# Altium schematic sheet catt.SchDoc
size A4
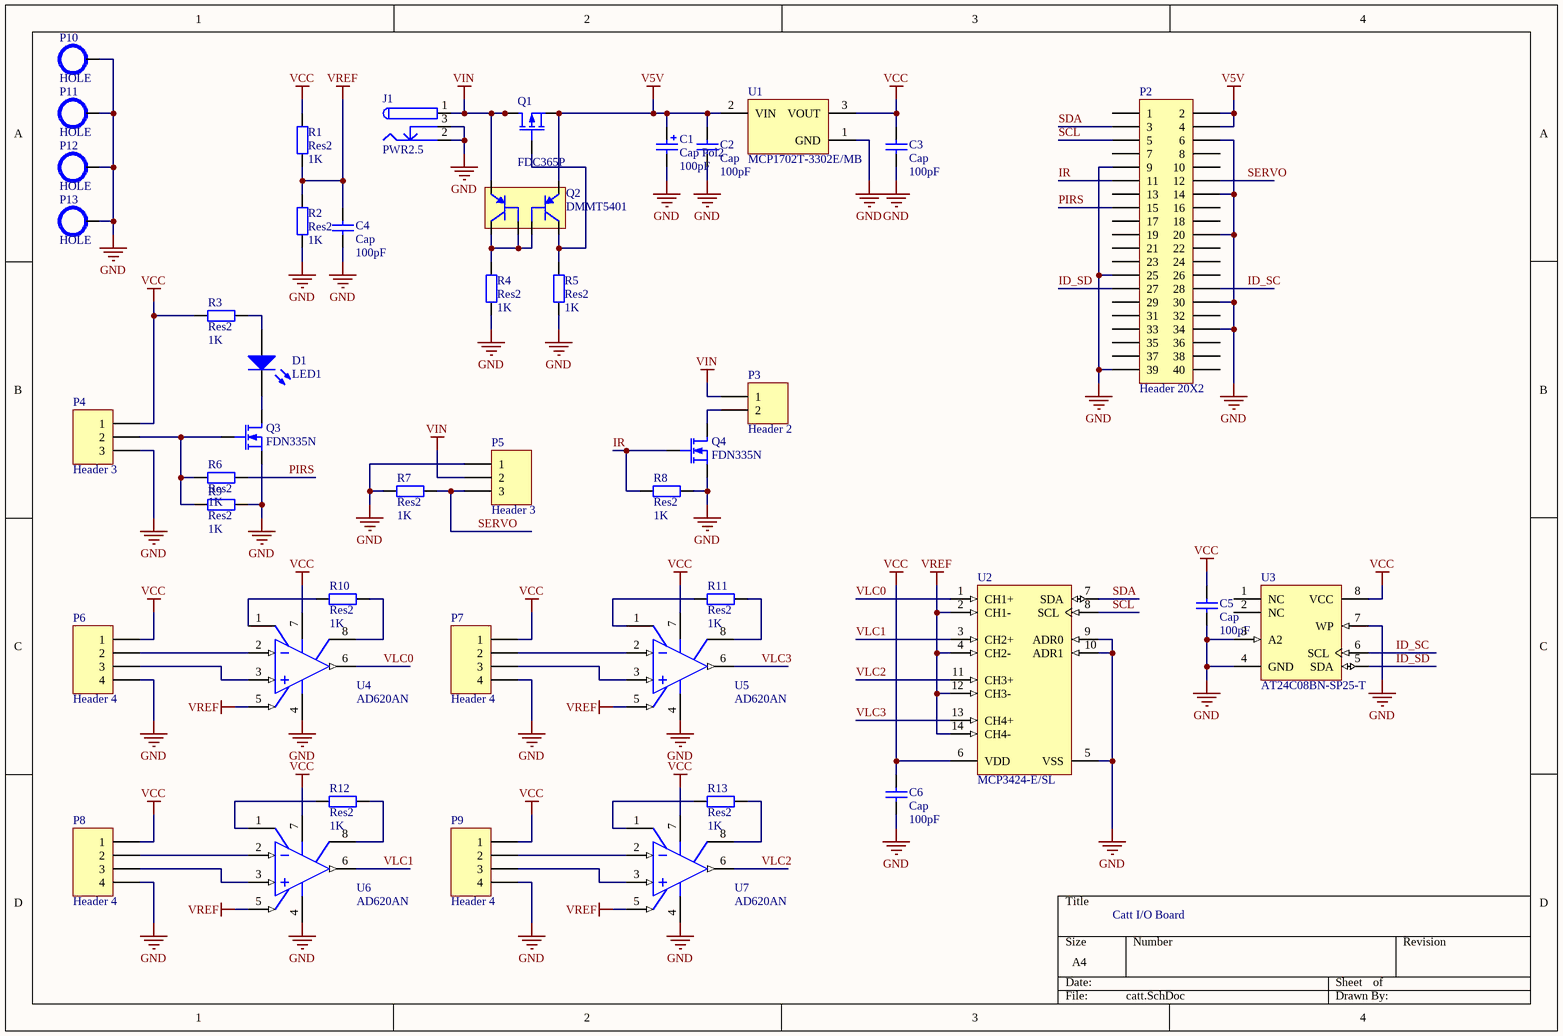
[diagram p0: catt.SchDoc]

## Parts
C1  Cap Pol2  value 100pF  [6-0805_N]
C2  Cap  value 100pF  [1608[0603]]
C3  Cap  value 100pF  [1608[0603]]
C4  Cap  value 100pF  [1608[0603]]
C5  Cap  value 100pF  [1608[0603]]
C6  Cap  value 100pF  [1608[0603]]
D1  LED1  [1608[0603]]
J1  PWR2.5  [MJ-180PH]
P2  Header 20X2  [HDR2X20]
P3  Header 2  [HDR1X2]
P4  Header 3  [HDR1X3]
P5  Header 3  [HDR1X3]
P6  Header 4  [HDR1X4]
P7  Header 4  [HDR1X4]
P8  Header 4  [HDR1X4]
P9  Header 4  [HDR1X4]
P10  HOLE  [HOLE]
P11  HOLE  [HOLE]
P12  HOLE  [HOLE]
P13  HOLE  [HOLE]
Q1  FDC365P  [SOT23-6]
Q2  DMMT5401  [SOT23-6]
Q3  FDN335N  [SOT-23]
Q4  FDN335N  [SOT-23]
R1  Res2  value 1K  [J1-0603]
R2  Res2  value 1K  [J1-0603]
R3  Res2  value 1K  [J1-0603]
R4  Res2  value 1K  [J1-0603]
R5  Res2  value 1K  [J1-0603]
R6  Res2  value 1K  [J1-0603]
R7  Res2  value 1K  [J1-0603]
R8  Res2  value 1K  [J1-0603]
R9  Res2  value 1K  [J1-0603]
R10  Res2  value 1K  [J1-0603]
R11  Res2  value 1K  [J1-0603]
R12  Res2  value 1K  [J1-0603]
R13  Res2  value 1K  [J1-0603]
U1  MCP1702T-3302E/MB  [SOT-89-MB3_N]
U2  MCP3424-E/SL  [SOIC-SL14_N]
U3  AT24C08BN-SP25-T  [8S1_N]
U4  AD620AN  [SO-8_L]
U5  AD620AN  [SO-8_L]
U6  AD620AN  [SO-8_L]
U7  AD620AN  [SO-8_L]

## Nets
GND: C1.2 C2.1 C3.1 C4.1 C5.1 C6.1 J1.2 J1.3 P2.6 P2.9 P2.14 P2.20 P2.25 P2.30 P2.34 P2.39 P4.3 P5.1 P6.4 P7.4 P8.4 P9.4 P10.0 P11.0 P12.0 P13.0 Q3.2(S) Q4.2(S) R2.1 R4.1 R5.1 R7.2 R8.2 R9.2 U1.1(GND) U2.5(VSS) U2.9(ADR0) U2.10(ADR1) U3.3(A2) U3.4(GND) U3.7(WP) U4.4(V-) U5.4(V-) U6.4(V-) U7.4(V-)
V5V: C1.1 C2.2 P2.2 P2.4 Q1.4(S) Q2.5(E2) U1.2(VIN)
VCC: C3.2 C5.2 C6.2 P4.1 P6.1 P7.1 P8.1 P9.1 R1.2 R3.2 U1.3(VOUT) U2.6(VDD) U3.8(VCC) U4.7(V+) U5.7(V+) U6.7(V+) U7.7(V+)
VIN: J1.1 P3.1 P5.2 Q1.1(D) Q1.2(D) Q1.5(D) Q1.6(D) Q2.6(E1)
VREF: C4.2 R1.1 R2.2 U2.2(CH1-) U2.4(CH2-) U2.12(CH3-) U2.14(CH4-) U4.5(REF) U5.5(REF) U6.5(REF) U7.5(REF)
ID_SC: P2.28 U3.6(SCL)
ID_SD: P2.27 U3.5(SDA)
IR: P2.11 Q4.1(G) R8.1
PIRS: P2.15 R6.2
SCL: P2.5 U2.8(SCL)
SDA: P2.3 U2.7(SDA)
SERVO: P2.12 P5.3 R7.1
VLC0: U2.1(CH1+) U4.6(OUT)
VLC1: U2.3(CH2+) U6.6(OUT)
VLC2: U2.11(CH3+) U7.6(OUT)
VLC3: U2.13(CH4+) U5.6(OUT)
NetD1_1: D1.1(A) R3.1
NetD1_2: D1.2(K) Q3.3(D)
NetP3_2: P3.2 Q4.3(D)
NetP4_2: P4.2 Q3.1(G) R6.1 R9.1
NetP6_2: P6.2 U4.2(-IN)
NetP6_3: P6.3 U4.3(+IN)
NetP7_2: P7.2 U5.2(-IN)
NetP7_3: P7.3 U5.3(+IN)
NetP8_2: P8.2 U6.2(-IN)
NetP8_3: P8.3 U6.3(+IN)
NetP9_2: P9.2 U7.2(-IN)
NetP9_3: P9.3 U7.3(+IN)
NetQ1_3: Q1.3(G) Q2.4(C2) R5.2
NetQ2_1: Q2.1(C1) Q2.2(B1) Q2.3(B2) R4.2
NetR10_1: R10.1 U4.8(RG)
NetR10_2: R10.2 U4.1(RG)
NetR11_1: R11.1 U5.8(RG)
NetR11_2: R11.2 U5.1(RG)
NetR12_1: R12.1 U6.8(RG)
NetR12_2: R12.2 U6.1(RG)
NetR13_1: R13.1 U7.8(RG)
NetR13_2: R13.2 U7.1(RG)

Not connected (* = marked no-connect by the designer): P2 1 7 8 10 13 16 17 18 19 21 22 23 24 26 29 31 32 33 35 36 37 38 40; U3 1(NC) 2(NC)

## Notes on the sheet
- Catt I/O Board

## Library data of the parts
C1 = Cap Pol2: Polarized Capacitor (Axial); Published: 8-Jun-2000; LatestRevisionDate: 17-Jul-2002; LatestRevisionNote: Re-released for DXP Platform.; PackageReference: POLAR0.8; Publisher: Altium Limited; PackageDescription: Polarized Capacitor; 2 Leads
C2-C6 = Cap: Capacitor; Published: 8-Jun-2000; LatestRevisionDate: 17-Jul-2002; LatestRevisionNote: Re-released for DXP Platform.; PackageReference: RAD-0.3; Publisher: Altium Limited; PackageDescription: Radial Cap, Thru-Hole; 2 Leads; 0.3 in Pin Spacing
D1 = LED1: Typical RED GaAs LED; Published: 8-Jun-2000; LatestRevisionDate: 08-Jul-2005; LatestRevisionNote: Mech Layer 1 removed.; PackageReference: LED-1; Publisher: Altium Limited; PackageDescription: LED; 2 Leads
J1 = PWR2.5: Low Voltage Power Supply Connector; Published: 17-Dec-2003; DatasheetDocument: 09-May-2002; Publisher: Altium Limited; ComponentLink1Description: Manufacturer Link; ComponentLink1URL: http://domino.kycon.com/internet/Products.html; Farnell: 1737251
P2 = Header 20X2: Header, 20-Pin, Dual row; LatestRevisionDate: 17-Jul-2002; LatestRevisionNote: Re-released for DXP Platform.; Publisher: Altium Limited; Farnell: 2356148
P3 = Header 2: Header, 2-Pin; LatestRevisionDate: 17-Jul-2002; LatestRevisionNote: Re-released for DXP Platform.; Publisher: Altium Limited
P4 P5 = Header 3: Header, 3-Pin; LatestRevisionDate: 17-Jul-2002; LatestRevisionNote: Re-released for DXP Platform.; Publisher: Altium Limited
P6-P9 = Header 4: Header, 4-Pin; LatestRevisionDate: 17-Jul-2002; LatestRevisionNote: Re-released for DXP Platform.; Publisher: Altium Limited
P10-P13 = HOLE: Mountiong Hole
Q1 = FDC365P: P-Channel PowerTrench® MOSFET; Published: 8-Jun-2000; LatestRevisionDate: 17-Jul-2002; LatestRevisionNote: Re-released for DXP Platform.; PackageVersion: 1995/1996; PackageReference: E3; Publisher: Altium Limited; PackageDescription: TO, Flat Index; 3 In-Line, Axial Leads; Body Dia. 4.6mm; Lead Dia. 0.5 mm (max)
Q2 = DMMT5401: Matched PNP small signal transistor; Published: 8-Jun-2000; LatestRevisionDate: 29-May-2009; LatestRevisionNote: IPC-7351 Footprint Added.; PackageVersion: Aug-1999; PackageReference: SOT23-6; Publisher: Altium Limited; PackageDescription: 6-Pin SOT-23 Package 0.95 mm Pitch, 2.4 mm Lead Span
Q3 Q4 = FDN335N: N-Channel MOSFET; Published: 8-Jun-2000; LatestRevisionDate: 17-Jul-2002; LatestRevisionNote: Re-released for DXP Platform.; PackageVersion: 1995/1996; PackageReference: E3; Publisher: Altium Limited; PackageDescription: TO, Flat Index; 3 In-Line, Axial Leads; Body Dia. 4.6mm; Lead Dia. 0.5 mm (max)
R1-R13 = Res2: Resistor; Published: 8-Jun-2000; LatestRevisionDate: 17-Jul-2002; LatestRevisionNote: Re-released for DXP Platform.; PackageReference: AXIAL-0.4; Publisher: Altium Limited; PackageDescription: Axial Device, Thru-Hole; 2 Leads; 0.4 in Pin Spacing
U1 = MCP1702T-3302E/MB: 250 mA Low Quiescent Current LDO Regulator, 3-Pin SOT-89, Extended Temperature, Tape and Reel; Published: 29-Jan-2009; LatestRevisionDate: 02-Dec-2009; LatestRevisionNote: Updated to datasheet revision D, Jun-2009; DatasheetVersion: revD, Jun-2009; PackageVersion: revBB, Aug-2009; PackageReference: SOT-89-MB3; Publisher: Altium Limited; PackageDescription: 3-Lead Plastic Small Outline Transistor Header (MB) [SOT-89]; Supplier 1: Digi-Key; Supplier Part Number 1: MCP1702T-3302E/MB-ND; Supplier 2: Farnell; Supplier Part Number 2: 1605558; Code_IPC: SOT89; ComponentLink1Description: Datasheet; ComponentLink1URL: http://ww1.microchip.com/downloads/en/DeviceDoc/22008d.pdf; ComponentLink2Description: Packaging Specification; ComponentLink2URL: http://www.microchip.com/stellent/groups/techpub_sg/documents/packagingspec/en012702.pdf; ComponentLink3Description: Microchip.com Home; ComponentLink3URL: http://www.microchip.com/; Farnell: 1605558
U2 = MCP3424-E/SL: 18-Bit, 4-Channel Analog-to-Digital Converter with I2C Interface and On-Board Reference, 14-Pin SOIC 150mil, Extended Temperature; Published: 29-Jan-2009; LatestRevisionDate: 02-Dec-2009; LatestRevisionNote: Updated to datasheet revision C, Aug-2009; DatasheetVersion: revC, Aug-2009; PackageVersion: revBB, Aug-2009; PackageReference: SOIC-SL14; Publisher: Altium Limited; PackageDescription: 14-Lead Plastic Small Outline (SL) - Narrow, 3.90mm Body [SOIC]; Supplier 1: Digi-Key; Supplier Part Number 1: MCP3424-E/SL-ND; Supplier 2: Farnell; Supplier Part Number 2: 1630424; Code_JEDEC: MS-012-AB; Code_IPC: SOIC127P600-14; ComponentLink1Description: Datasheet; ComponentLink1URL: http://ww1.microchip.com/downloads/en/DeviceDoc/22088c.pdf; ComponentLink2Description: Packaging Specification; ComponentLink2URL: http://www.microchip.com/stellent/groups/techpub_sg/documents/packagingspec/en012702.pdf; ComponentLink3Description: Microchip.com Home; ComponentLink3URL: http://www.microchip.com/
U3 = AT24C08BN-SP25-T: 8Kbit (1024 x 8), 2-wire Bus Automotive Serial EEPROM with Write Protect, 2.5V, 8-Pin SOIC, Tape & Reel; Published: 20-Sep-2010; DatasheetVersion: 8517C,  Jan-2009; PackageVersion: revC, Mar-2005; PackageReference: 8S1; Publisher: Altium Limited; PackageDescription: 8-Lead (0.150" Wide Body), Plastic Gull Wing Small Outline (JEDEC SOIC); Code_JEDEC: MS-012-AA; Code_IPC: SOIC127P600-8; ComponentLink1Description: Manufacturer Link; ComponentLink1URL: http://www.atmel.com/products/serial/default.asp; ComponentLink2Description: Datasheet; ComponentLink2URL: http://www.atmel.com/dyn/resources/prod_documents/doc8517.pdf; ComponentLink3Description: Atmel.com Home; ComponentLink3URL: http://www.atmel.com
U4-U7 = AD620AN: Low-Cost, Low-Power Instrumentation Amplifier; Published: 8-Jun-2000; LatestRevisionDate: 04-Mar-2005; LatestRevisionNote: Stylized 3D Model Added.; DatasheetVersion: REV.D 1998; PackageVersion: revA; PackageReference: N-8; Publisher: Altium Limited; PackageDescription: DIP; 8 Leads; Row Spacing 7.62 mm; Pitch 2.54 mm; ComponentLink1Description: Manufacturer Link; ComponentLink1URL: http://www.analog.com/en/prod/0%2C2877%2CAD620%2C00.html; ComponentLink2Description: Datasheet; ComponentLink2URL: http://www.analog.com/UploadedFiles/Data_Sheets/897653854AD620_g.pdf